# Altium project 8-Solenoid-Board.PrjPcb
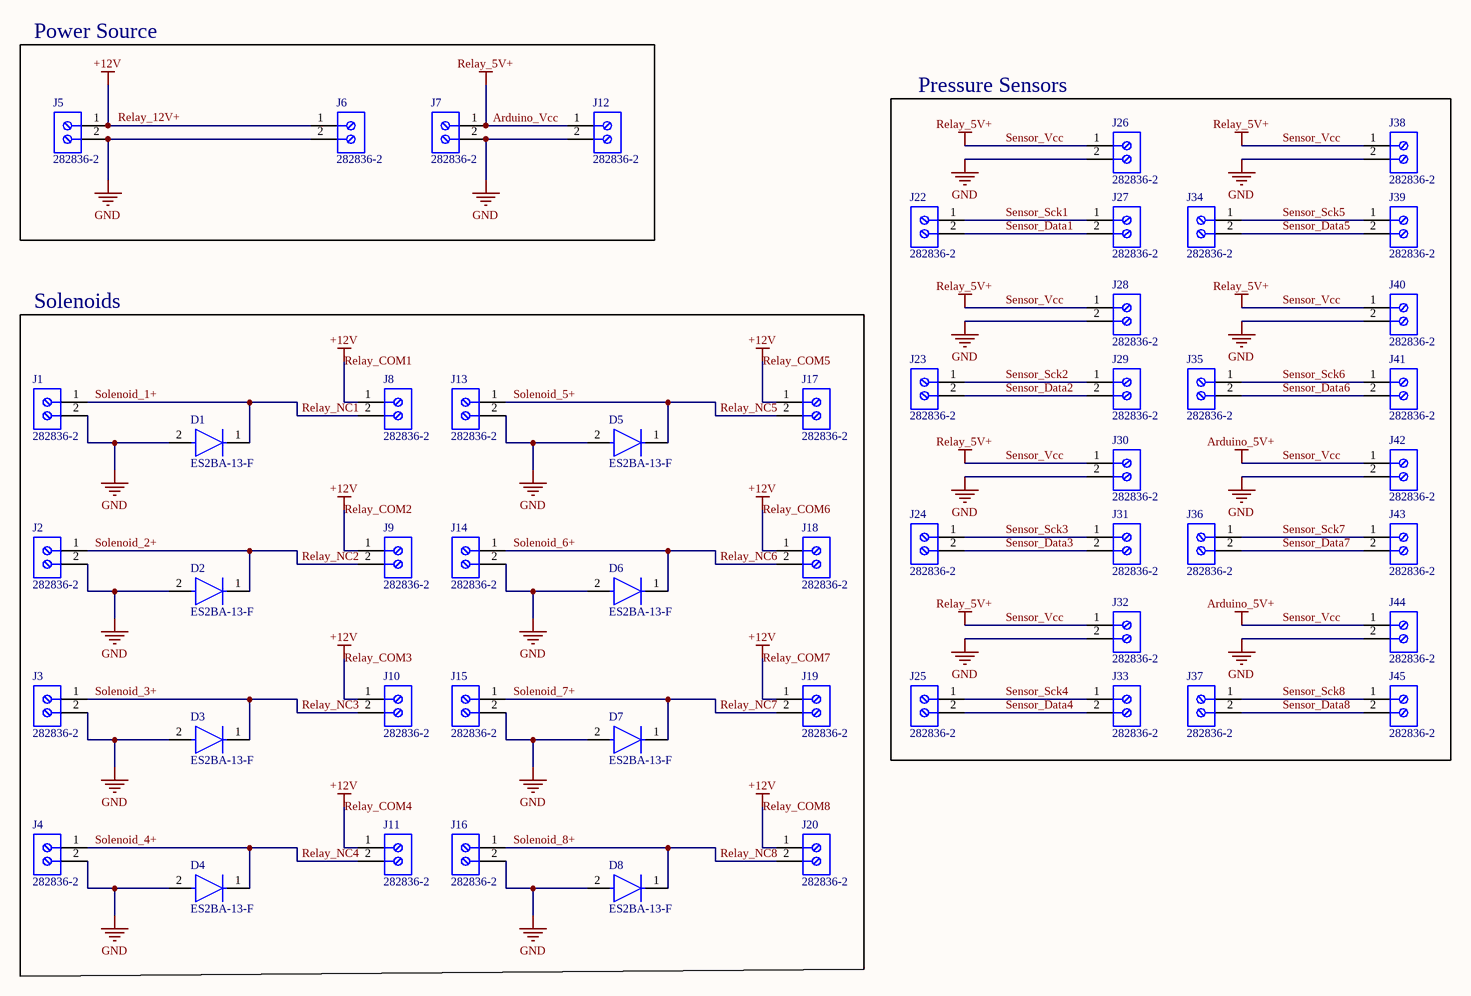
[diagram p0: 8-Solenoid-Schematic.SchDoc]
1 sheet, 52 parts. Net scope: global (net labels, ports and power ports of the same name join across sheets).
Board file: 8-Solenoid-PCB.PcbDoc

## Sheet 8-Solenoid-Schematic.SchDoc
size 381 x 241 mm; SheetNumber: 1; SheetTotal: 1

### Parts
D1  ES2BA-13-F  [FP-SMA-MFG]
D2  ES2BA-13-F  [FP-SMA-MFG]
D3  ES2BA-13-F  [FP-SMA-MFG]
D4  ES2BA-13-F  [FP-SMA-MFG]
D5  ES2BA-13-F  [FP-SMA-MFG]
D6  ES2BA-13-F  [FP-SMA-MFG]
D7  ES2BA-13-F  [FP-SMA-MFG]
D8  ES2BA-13-F  [FP-SMA-MFG]
J1  282836-2  [TECO-282836-2_V]
J2  282836-2  [TECO-282836-2_V]
J3  282836-2  [TECO-282836-2_V]
J4  282836-2  [TECO-282836-2_V]
J5  282836-2  [TECO-282836-2_V]
J6  282836-2  [TECO-282836-2_V]
J7  282836-2  [TECO-282836-2_V]
J8  282836-2  [TECO-282836-2_V]
J9  282836-2  [TECO-282836-2_V]
J10  282836-2  [TECO-282836-2_V]
J11  282836-2  [TECO-282836-2_V]
J12  282836-2  [TECO-282836-2_V]
J13  282836-2  [TECO-282836-2_V]
J14  282836-2  [TECO-282836-2_V]
J15  282836-2  [TECO-282836-2_V]
J16  282836-2  [TECO-282836-2_V]
J17  282836-2  [TECO-282836-2_V]
J18  282836-2  [TECO-282836-2_V]
J19  282836-2  [TECO-282836-2_V]
J20  282836-2  [TECO-282836-2_V]
J22  282836-2  [TECO-282836-2_V]
J23  282836-2  [TECO-282836-2_V]
J24  282836-2  [TECO-282836-2_V]
J25  282836-2  [TECO-282836-2_V]
J26  282836-2  [TECO-282836-2_V]
J27  282836-2  [TECO-282836-2_V]
J28  282836-2  [TECO-282836-2_V]
J29  282836-2  [TECO-282836-2_V]
J30  282836-2  [TECO-282836-2_V]
J31  282836-2  [TECO-282836-2_V]
J32  282836-2  [TECO-282836-2_V]
J33  282836-2  [TECO-282836-2_V]
J34  282836-2  [TECO-282836-2_V]
J35  282836-2  [TECO-282836-2_V]
J36  282836-2  [TECO-282836-2_V]
J37  282836-2  [TECO-282836-2_V]
J38  282836-2  [TECO-282836-2_V]
J39  282836-2  [TECO-282836-2_V]
J40  282836-2  [TECO-282836-2_V]
J41  282836-2  [TECO-282836-2_V]
J42  282836-2  [TECO-282836-2_V]
J43  282836-2  [TECO-282836-2_V]
J44  282836-2  [TECO-282836-2_V]
J45  282836-2  [TECO-282836-2_V]

### Blocks framed on the sheet
Pressure Sensors: J22-J45
Solenoids: D1-D8 J1-J4 J8-J11 J13-J20

### Nets
Arduino_Vcc: J7.1 J12.1 J26.1 J28.1 J30.1 J32.1 J38.1 J40.1 J42.1 J44.1  [also labelled Arduino_5V+, Relay_5V+, Sensor_Vcc]
GND: D1.2(A) D2.2(A) D3.2(A) D4.2(A) D5.2(A) D6.2(A) D7.2(A) D8.2(A) J1.2 J2.2 J3.2 J4.2 J5.2 J6.2 J7.2 J12.2 J13.2 J14.2 J15.2 J16.2 J26.2 J28.2 J30.2 J32.2 J38.2 J40.2 J42.2 J44.2
Relay_12V+: J5.1 J6.1 J8.1 J9.1 J10.1 J11.1 J17.1 J18.1 J19.1 J20.1  [also labelled +12V, Relay_COM1, Relay_COM2, Relay_COM3, Relay_COM4, Relay_COM5, Relay_COM6, Relay_COM7, Relay_COM8]
Relay_NC1: D1.1(C) J1.1 J8.2  [also labelled Solenoid_1+]
Relay_NC2: D2.1(C) J2.1 J9.2  [also labelled Solenoid_2+]
Relay_NC3: D3.1(C) J3.1 J10.2  [also labelled Solenoid_3+]
Relay_NC4: D4.1(C) J4.1 J11.2  [also labelled Solenoid_4+]
Relay_NC5: D5.1(C) J13.1 J17.2  [also labelled Solenoid_5+]
Relay_NC6: D6.1(C) J14.1 J18.2  [also labelled Solenoid_6+]
Relay_NC7: D7.1(C) J15.1 J19.2  [also labelled Solenoid_7+]
Relay_NC8: D8.1(C) J16.1 J20.2  [also labelled Solenoid_8+]
Sensor_Data1: J22.2 J27.2
Sensor_Data2: J23.2 J29.2
Sensor_Data3: J24.2 J31.2
Sensor_Data4: J25.2 J33.2
Sensor_Data5: J34.2 J39.2
Sensor_Data6: J35.2 J41.2
Sensor_Data7: J36.2 J43.2
Sensor_Data8: J37.2 J45.2
Sensor_Sck1: J22.1 J27.1
Sensor_Sck2: J23.1 J29.1
Sensor_Sck3: J24.1 J31.1
Sensor_Sck4: J25.1 J33.1
Sensor_Sck5: J34.1 J39.1
Sensor_Sck6: J35.1 J41.1
Sensor_Sck7: J36.1 J43.1
Sensor_Sck8: J37.1 J45.1

### Notes on the sheet
- Power Source

### Library data of the parts
D1-D8 = CMP-12791-000037-1: DIODE GEN PURP 100V 2A SMA; Manufacturer: Diodes Inc.; Standoff Height: 0.05mm; Value: 25pF; Peak Reverse Current: 5uA; Max Junction Temp: +150°C; Max Surge Forward Current: 50A; Digikey Description: DIODE GEN PURP 100V 2A SMA; Max Repetitive Reverse Voltage: 100V; Mouser Description: ES2BA Series 100 V 2 A Surface Mount Super-Fast Rectifier - DO-214AC; RoHS: TRUE; Device Class L3: Rectifier Diodes; Height: 2.4mm; Footprint Url: https://www.diodes.com/assets/Package-Files/SMA.pdf; Lead Free: Yes; Device Class L1: Discrete Semiconductors; Forward Current: 2A; ComponentLink2Description: Datasheet; Manufacturer Part Number: ES2BA-13-F; Temperature: -55°C to +150°C; Temperature Range Low: -55°C; Automotive: No; Device Class L2: Diodes; Category: Diode; Octopart: https://octopart.com/es2ba-13-f-diodes+inc.-14402013; Package: SMA; Capacitance: 25pF; ComponentLink2URL: https://www.diodes.com/assets/Datasheets/ds14002.pdf; Reverse Voltage: 100V; Temperature Range High: +150°C
J1-J20 J22-J45 = CMP-1684-00017-1: Female Header, Pitch 5 mm, 1 x 2 Position, Height 10 mm, Tail Length 3.5 mm, Rohs, Bulk; Manufacturer: TE Connectivity; Wire Gauge: 16-30AWG; Product Training Modules: Wire-to-BoardEurostyleTerminalBlocks; Clamp Material - Plating: Brass-NickelPlated; Voltage: 300V; Mating Orientation: HorizontalwithBoard; Current: 13.5A; Pitch: 0.197"(5.00mm); Screw Thread: M3; 3D Model: 282836-2.pdf; Other Names: 5ULV-02B / A98076; Dynamic Catalog: BuchananSeries; Number of Levels: 1; Torque - Screw: 0.68Nm(6Lb-In); Featured Product: EurostyleTerminalBlockConnectors; Positions Per Level: 2; Wire Termination: Screw-RisingCageClamp; Datasheet URL: http://www.te.com.cn/commerce/DocumentDelivery/DDEController?Action=showdoc&DocId=Catalog+Section%7F1308389_EUROSTYLE_TERMINAL_BLOCKS%7F0607%7Fpdf%7FEnglish%7FENG_CS_1308389_EUROSTYLE_TERMINAL_BLOCKS_0607.pdf%7F282836-2; Color: Green; Family: TerminalBlocks-WiretoBoard; RoHS Information: 282836-2StatementofCompliance; Standard Package: 300; Contact Material - Plating: Brass-TinPlated; Manufacturer URL: http://www.te.com; Housing Material: Polyamide(PA66),Nylon6/6; Features: Interlocking(Side); Package Description: Female Header, Pitch 5 mm, 1 x 2 Position, Height 10 mm, Tail Length 3.5 mm; Mounting Type: ThroughHole; Package Reference: THD; Packaging: Bulk; Series: Buchanan; Category: Connectors,Interconnects; Screw Material - Plating: Brass-NickelPlated